# EAGLE schematic Schematic_MON-14 (EAGLE 9.7.0)
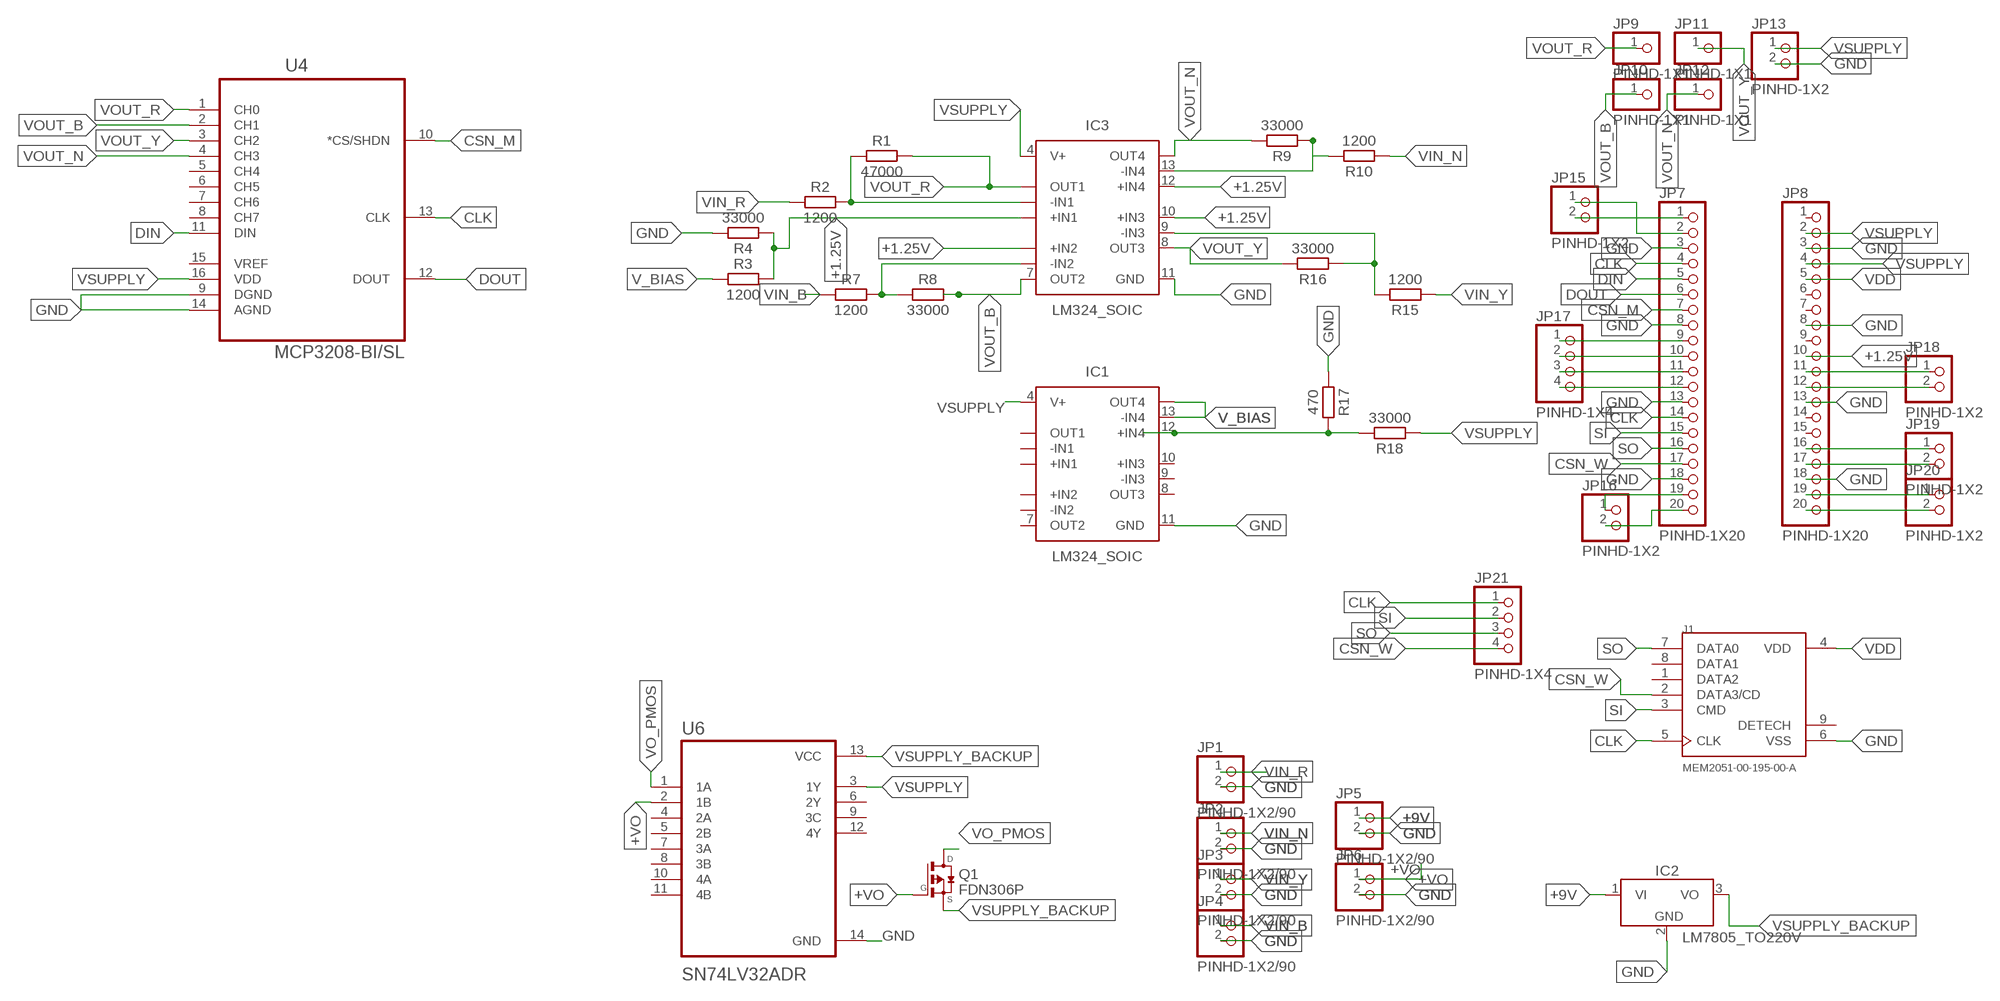
[diagram p0: schematic, sheet 1]

## Parts
IC1  LM324_SOIC  [SOIC127P600X175-14N]
IC2  LM7805_TO220V  [TO220V]
IC3  LM324_SOIC  [SOIC127P600X175-14N]
J1  MEM2051-00-195-00-A  [GCT_MEM2051-00-195-00-A]
JP1  PINHD-1X2/90  [1X02/90]
JP2  PINHD-1X2/90  [1X02/90]
JP3  PINHD-1X2/90  [1X02/90]
JP4  PINHD-1X2/90  [1X02/90]
JP5  PINHD-1X2/90  [1X02/90]
JP6  PINHD-1X2/90  [1X02/90]
JP7  PINHD-1X20  [1X20]
JP8  PINHD-1X20  [1X20]
JP9  PINHD-1X1  [1X01]
JP10  PINHD-1X1  [1X01]
JP11  PINHD-1X1  [1X01]
JP12  PINHD-1X1  [1X01]
JP13  PINHD-1X2  [1X02]
JP15  PINHD-1X2  [1X02]
JP16  PINHD-1X2  [1X02]
JP17  PINHD-1X4  [1X04]
JP18  PINHD-1X2  [1X02]
JP19  PINHD-1X2  [1X02]
JP20  PINHD-1X2  [1X02]
JP21  PINHD-1X4  [1X04]
Q1  FDN306P  [SSOT-3]
R1  47000  R_CHIP-1206(3216-METRIC)  [RESC3216X70]
R2  1200  R_CHIP-1206(3216-METRIC)  [RESC3216X70]
R3  1200  R_CHIP-1206(3216-METRIC)  [RESC3216X70]
R4  33000  R_CHIP-1206(3216-METRIC)  [RESC3216X70]
R7  1200  R_CHIP-1206(3216-METRIC)  [RESC3216X70]
R8  33000  R_CHIP-1206(3216-METRIC)  [RESC3216X70]
R9  33000  R_CHIP-1206(3216-METRIC)  [RESC3216X70]
R10  1200  R_CHIP-1206(3216-METRIC)  [RESC3216X70]
R15  1200  R_CHIP-1206(3216-METRIC)  [RESC3216X70]
R16  33000  R_CHIP-1206(3216-METRIC)  [RESC3216X70]
R17  470  R_CHIP-1206(3216-METRIC)  [RESC3216X70]
R18  33000  R_CHIP-1206(3216-METRIC)  [RESC3216X70]
U4  MCP3208-BI/SL  [SOIC127P600X175-16N]
U6  SN74LV32ADR  [SOIC127P600X175-14N]

## Nets
+1.25V: IC3.3(+IN1) IC3.5(+IN2) IC3.10(+IN3) IC3.12(+IN4) JP8.10 R3.2 R4.1
+9V: IC2.1(VI) JP5.1
+VO: JP6.1 Q1.1(G) U6.2(1B)
CLK: J1.5(CLK) JP7.4 JP7.14 JP21.1 U4.13(CLK)
CSN_M: JP7.7 U4.10(*CS/SHDN)
CSN_W: J1.2(DATA3/CD) JP7.17 JP21.4
DIN: JP7.5 U4.11(DIN)
DOUT: JP7.6 U4.12(DOUT)
GND: IC1.11(GND) IC2.2(GND) IC3.11(GND) J1.6(VSS) JP1.2 JP2.2 JP3.2 JP4.2 JP5.2 JP6.2 JP7.3 JP7.8 JP7.13 JP7.18 JP8.3 JP8.8 JP8.13 JP8.18 JP13.2 R4.2 R17.1 U4.9(DGND) U4.14(AGND) U6.14(GND)
N$1: JP8.20 JP20.2
N$2: JP8.19 JP20.1
N$3: JP8.17 JP19.2
N$4: IC3.6(-IN2) R7.2 R8.1
N$5: IC3.9(-IN3) R15.2 R16.1
N$6: JP8.16 JP19.1
N$7: JP7.9 JP17.1
N$8: IC3.2(-IN1) R1.1 R2.2
N$9: IC3.13(-IN4) R9.1 R10.2
N$10: JP7.10 JP17.2
N$11: JP7.11 JP17.3
N$12: JP7.12 JP17.4
N$13: IC1.12(+IN4) R17.2 R18.2
N$15: JP7.19 JP16.1
N$16: JP7.20 JP16.2
N$17: JP7.1 JP15.2
N$18: JP7.2 JP15.1
N$19: JP8.11 JP18.1
N$20: JP8.12 JP18.2
SI: J1.3(CMD) JP7.15 JP21.2
SO: J1.7(DATA0) JP7.16 JP21.3
V_BIAS: IC1.13(-IN4) IC1.14(OUT4) R3.1
VDD: J1.4(VDD) JP8.5
VIN_B: JP4.1 R7.1
VIN_N: JP2.1 R10.1
VIN_R: JP1.1 R2.1
VIN_Y: JP3.1 R15.1
VO_PMOS: Q1.3(D) U6.1(1A)
VOUT_B: IC3.7(OUT2) JP10.1 R8.2 U4.2(CH1)
VOUT_N: IC3.14(OUT4) JP12.1 R9.2 U4.4(CH3)
VOUT_R: IC3.1(OUT1) JP9.1 R1.2 U4.1(CH0)
VOUT_Y: IC3.8(OUT3) JP11.1 R16.2 U4.3(CH2)
VSUPPLY: IC1.4(V+) IC3.4(V+) JP8.2 JP8.4 JP13.1 R18.1 U4.16(VDD) U6.3(1Y)
VSUPPLY_BACKUP: IC2.3(VO) Q1.2(S) U6.13(VCC)
Unconnected: IC1.1(OUT1) IC1.2(-IN1) IC1.3(+IN1) IC1.5(+IN2) IC1.6(-IN2) IC1.7(OUT2) IC1.8(OUT3) IC1.9(-IN3) IC1.10(+IN3) J1.1(DATA2) J1.8(DATA1) J1.9(DETECH) JP8.1 JP8.6 JP8.7 JP8.9 JP8.14 JP8.15 U4.5(CH4) U4.6(CH5) U4.7(CH6) U4.8(CH7) U4.15(VREF) U6.4(2A) U6.5(2B) U6.6(2Y) U6.7(3A) U6.8(3B) U6.9(3C) U6.10(4A) U6.11(4B) U6.12(4Y)

## Library data of the parts
IC1 IC3 = IC_Linear:LM324: Quad-Operational Amplifiers Reference Datasheet <https://www.ti.com/lit/ds/snosc16d/snosc16d.pdf>; CATEGORY: Amplifier; DESCRIPTION: Quad-Operational Amplifiers; MANUFACTURER: Generic; MPN: Generic; SERIES: LM324; SUB-CATEGORY: OpAmp; TYPE: Quad
IC2 = IC_Power-Management:LM7805: 5V Voltage Regulator Reference Datasheet <https://www.ti.com/lit/ds/symlink/lm340.pdf>; CATEGORY: IC_Linear; DESCRIPTION: 5V Voltage Regulator; MANUFACTURER: Generic; MPN: Generic; SERIES: LM7805; SUB-CATEGORY: Voltage Regulator; TYPE: 5V
J1 = MEM2051-00-195-00-A:MEM2051-00-195-00-A: Connector, Memory Card, Micro Sd, 8 Position, 1.1mm, Full Reel; MANUFACTURER: GCT
JP1-JP6 JP13 JP15 JP16 JP18-JP20 = Connector:PINHD-1X2: PIN HEADER; CATEGORY: CONNECTOR; SUB-CATEGORY: PIN-HEADER
JP7 JP8 = Connector:PINHD-1X20: PIN HEADER; CATEGORY: CONNECTOR; SUB-CATEGORY: PIN-HEADER
JP9-JP12 = Connector:PINHD-1X1: PIN HEADER; CATEGORY: CONNECTOR; SUB-CATEGORY: PIN-HEADER
JP17 JP21 = Connector:PINHD-1X4: PIN HEADER; CATEGORY: CONNECTOR; SUB-CATEGORY: PIN-HEADER
Q1 = FDN306P:FDN306P: P-Channel MOSFET 1.8V Specified PowerTrench
R1-R4 R7-R10 R15-R18 = Resistor:R: Resistor Fixed - Generic; CATEGORY: Resistor; SUB-CATEGORY: Fixed
U4 = MCP3208-BI_SL:MCP3208-BI/SL: IC, 12 ADC, SMD, 3208; MPN: MCP3208-BI/SL; OC_FARNELL: 1084270; OC_NEWARK: 69K7605; PACKAGE: SOIC16; SUPPLIER: Microchip
U6 = SN74LV32ADR:SN74LV32ADR: None; MANUFACTURER: Texas Instruments; PACKAGE: SOIC127P600X175-14N